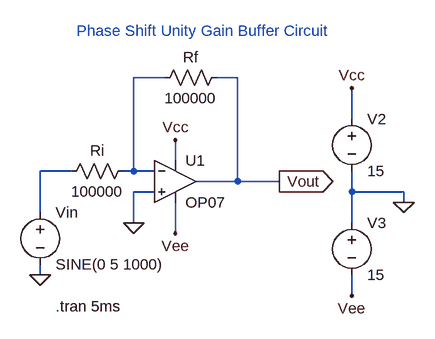
[diagram p0: schematic Assignment 6c.asc]
Assignment 6c.asc, the LTspice schematic file:
Version 4
SHEET 1 880 680
WIRE 160 16 112 16
WIRE 272 16 240 16
WIRE 448 80 448 32
WIRE 176 144 176 112
WIRE 16 160 -32 160
WIRE 112 160 112 16
WIRE 112 160 96 160
WIRE 144 160 112 160
WIRE 272 176 272 16
WIRE 272 176 208 176
WIRE 336 176 272 176
WIRE 144 192 112 192
WIRE 448 192 448 160
WIRE 528 192 448 192
WIRE 528 208 528 192
WIRE -32 224 -32 160
WIRE 112 240 112 192
WIRE 448 240 448 192
WIRE 176 256 176 208
WIRE -32 320 -32 304
WIRE 448 352 448 320
FLAG 528 208 0
FLAG -32 320 0
FLAG 448 32 Vcc
FLAG 176 112 Vcc
FLAG 448 352 Vee
FLAG 176 256 Vee
FLAG 336 176 Vout
IOPIN 336 176 Out
FLAG 112 240 0
SYMBOL Opamps\\OP07 176 112 R0
SYMATTR InstName U1
SYMBOL voltage -32 208 R0
WINDOW 123 0 0 Left 2
WINDOW 39 0 0 Left 2
SYMATTR InstName Vin
SYMATTR Value SINE(0 5 1000)
SYMBOL voltage 448 64 R0
WINDOW 123 0 0 Left 2
WINDOW 39 0 0 Left 2
SYMATTR InstName V2
SYMATTR Value 15
SYMBOL voltage 448 224 R0
WINDOW 123 0 0 Left 2
WINDOW 39 0 0 Left 2
SYMATTR InstName V3
SYMATTR Value 15
SYMBOL res 256 0 R90
WINDOW 0 0 56 VBottom 2
WINDOW 3 32 56 VTop 2
SYMATTR InstName Rf
SYMATTR Value 100000
SYMBOL res 112 144 R90
WINDOW 0 0 56 VBottom 2
WINDOW 3 32 56 VTop 2
SYMATTR InstName Ri
SYMATTR Value 100000
TEXT -8 368 Left 2 !.tran 5ms
TEXT 24 -56 Left 2 ;Phase Shift Unity Gain Buffer Circuit

The netlist it stands for:
* Assignment 6c.asc
XU1 0 N001 Vcc Vee Vout LT1001  ; OP07, pins In+ In- V+ V- OUT
Vin N002 0 SINE(0 5 1000)
V2 Vcc 0 15
V3 0 Vee 15
Rf Vout N001 100000
Ri N001 N002 100000
.tran 5ms
* Phase Shift Unity Gain Buffer Circuit
.lib LTC.lib
.backanno
.end